# EAGLE design powermon (EAGLE 6.5.0)
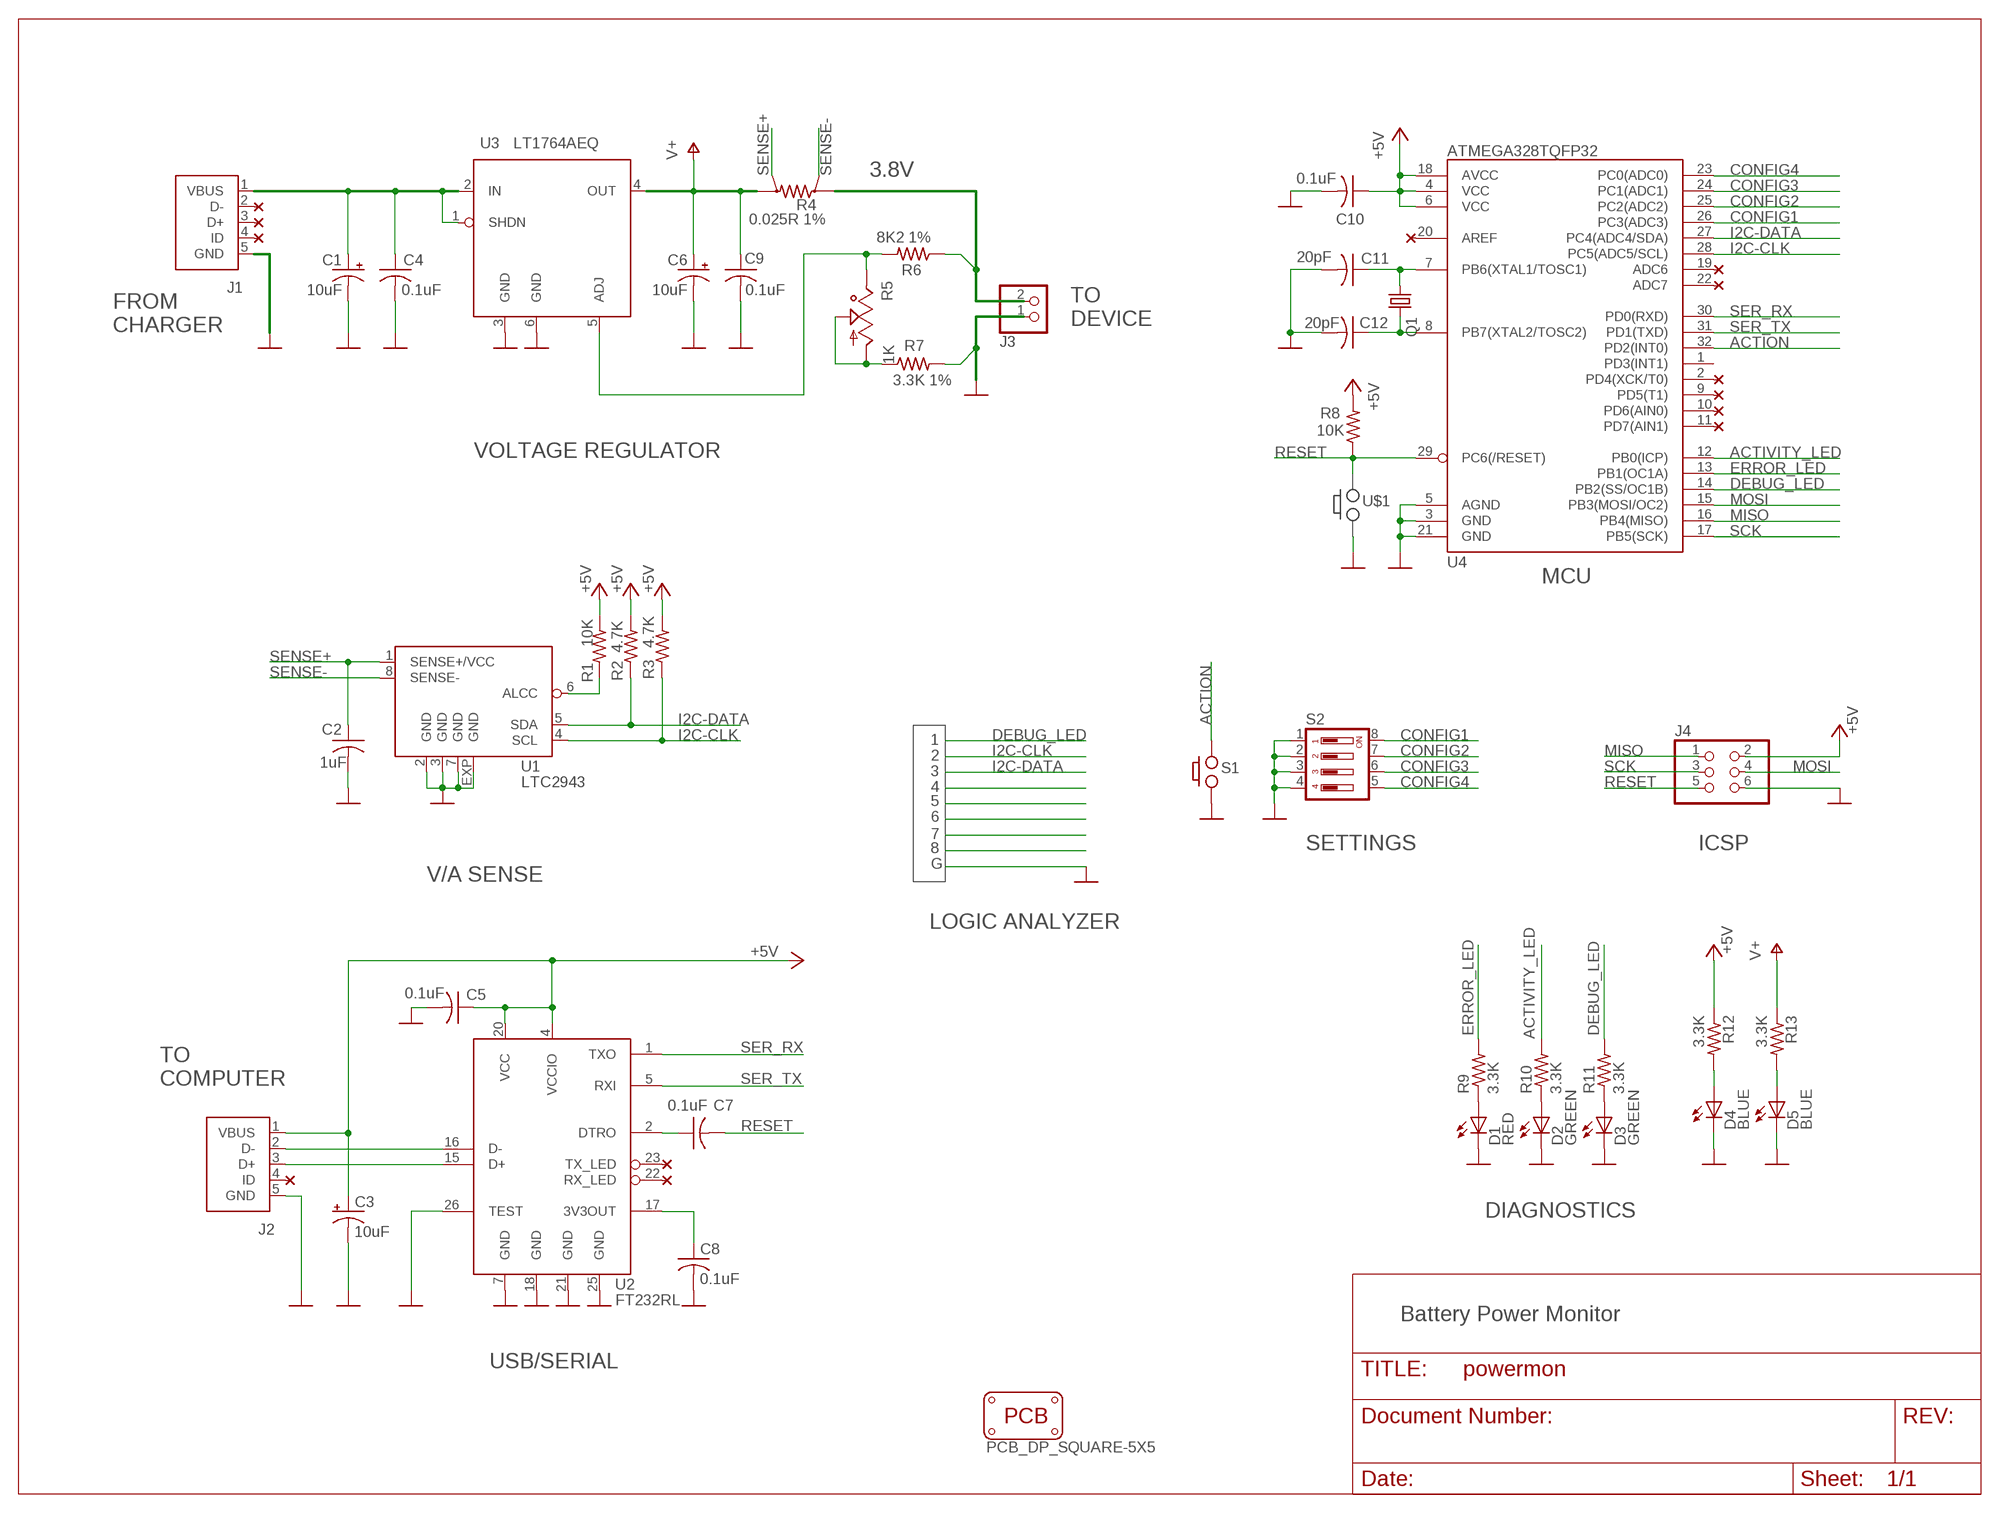
[diagram p0: schematic, sheet 1]

## Parts
C1  10uF  CPOL-USA/3216-18R  [A/3216-18R]
C2  1uF  C-USC0603  [C0603]
C3  10uF  CPOL-USA/3216-18R  [A/3216-18R]
C4  0.1uF  C-USC0603  [C0603]
C5  0.1uF  C-USC0603  [C0603]
C6  10uF  CPOL-USA/3216-18R  [A/3216-18R]
C7  0.1uF  C-USC0603  [C0603]
C8  0.1uF  C-USC0603  [C0603]
C9  0.1uF  C-USC0603  [C0603]
C10  0.1uF  C-USC0603  [C0603]
C11  20pF  C-USC0603  [C0603]
C12  20pF  C-USC0603  [C0603]
D1  RED  LED  [1206-LED]
D2  GREEN  LED  [1206-LED]
D3  GREEN  LED  [1206-LED]
D4  BLUE  LED  [1206-LED]
D5  BLUE  LED  [1206-LED]
J1  USB  [USB-MICRO-ZX62RD-AB-5P8]
J2  USB  [USB-MICRO-ZX62RD-AB-5P8]
J3  TERMINAL-2  [TERMINAL-2]
J4  PINHD-2X3  [2X03]
PCB1  PCB_DP_SQUARE-5X5  [DP5050_V1]
Q1  CRYSTALCTS406  [CRYSTAL-CTS406]
R1  10K  R-US_R0603  [R0603]
R2  4.7K  R-US_R0603  [R0603]
R3  4.7K  R-US_R0603  [R0603]
R4  0.025R 1%  SHUNT  [SHUNT]
R5  1K  TRIM_US-SM-42/43A  [TRIM-POT_SM-42/43A]
R6  8K2 1%  R-US_R0603  [R0603]
R7  3.3K 1%  R-US_R0603  [R0603]
R8  10K  R-US_R0603  [R0603]
R9  3.3K  R-US_R0603  [R0603]
R10  3.3K  R-US_R0603  [R0603]
R11  3.3K  R-US_R0603  [R0603]
R12  3.3K  R-US_R0603  [R0603]
R13  3.3K  R-US_R0603  [R0603]
S1  PUSH_BUTTONEVQPSL  [EVQPSL-PUSH-BUTTON]
S2  219-04  [CTS-219-04]
U1  LTC2943  [DFN8-3X3]
U2  FT232RL  [SSOP28DB]
U3  LT1764AEQ  LTE1764  [TO263-5]
U4  ATMEGA328TQFP32  [TQFP32-08]

## Nets
+5V: C3.+ C5.1 C10.1 J2.1(VBUS) J4.2 R1.2 R2.2 R3.2 R8.2 R12.1 U2.4(VCCIO) U2.20(VCC) U4.4(VCC) U4.6(VCC) U4.18(AVCC)
ACTION: S1.1 U4.32(PD2(INT0))
ACTIVITY_LED: R10.2 U4.12(PB0(ICP))
CONFIG1: S2.8 U4.26(PC3(ADC3))
CONFIG2: S2.7 U4.25(PC2(ADC2))
CONFIG3: S2.6 U4.24(PC1(ADC1))
CONFIG4: S2.5 U4.23(PC0(ADC0))
DEBUG_LED: R11.2 U4.14(PB2(SS/OC1B))
ERROR_LED: R9.2 U4.13(PB1(OC1A))
GND: C1.- C2.2 C3.- C4.2 C5.2 C6.- C8.2 C9.2 C10.2 C11.2 C12.2 D1.C D2.C D3.C D4.C D5.C J1.5(GND) J2.5(GND) J3.1 J4.6 R7.2 S1.2 S2.1 S2.2 S2.3 S2.4 U1.2(GND) U1.3(GND) U1.7(GND) U1.EXP(GND) U2.7(GND) U2.18(GND) U2.21(GND) U2.25(GND) U2.26(TEST) U3.3(GND) U3.6(GND) U4.3(GND) U4.5(AGND) U4.21(GND)
I2C-CLK: R3.1 U1.4(SCL) U4.28(PC5(ADC5/SCL))
I2C-DATA: R2.1 U1.5(SDA) U4.27(PC4(ADC4/SDA))
MISO: J4.1 U4.16(PB4(MISO))
MOSI: J4.4 U4.15(PB3(MOSI/OC2))
N$1: R1.1 U1.6(ALCC)
N$2: C11.1 Q1.1 U4.7(PB6(XTAL1/TOSC1))
N$3: D2.A R10.1
N$4: D1.A R9.1
N$7: C12.1 Q1.3 U4.8(PB7(XTAL2/TOSC2))
N$9: C1.+ C4.1 J1.1(VBUS) U3.1(SHDN) U3.2(IN)
N$10: J2.3(D+) U2.15(D+)
N$11: C7.1 U2.2(DTRO)
N$14: D5.A R13.2
N$15: J2.2(D-) U2.16(D-)
N$16: C8.1 U2.17(3V3OUT)
N$17: D4.A R12.2
N$18: R5.1 R5.2 R7.1
N$19: R5.3 R6.2 U3.5(ADJ)
N$20: D3.A R11.1
N$22: J3.2 R4.I1 R6.1
RESET: C7.2 J4.5 R8.1 U4.29(PC6(/RESET))
SCK: J4.3 U4.17(PB5(SCK))
SENSE+: C2.1 R4.V2 U1.1(SENSE+/VCC)
SENSE-: R4.V1 U1.8(SENSE-)
SER_RX: U2.1(TXO) U4.30(PD0(RXD))
SER_TX: U2.5(RXI) U4.31(PD1(TXD))
V+: C6.+ C9.1 R4.I2 R13.1 U3.4(OUT)
Unconnected: J1.2(D-) J1.3(D+) J1.4(ID) J2.4(ID) U2.22(RX_LED) U2.23(TX_LED) U4.1(PD3(INT1)) U4.2(PD4(XCK/T0)) U4.9(PD5(T1)) U4.10(PD6(AIN0)) U4.11(PD7(AIN1)) U4.19(ADC6) U4.20(AREF) U4.22(ADC7)

## Notes on the sheet
- 3.8V
- TO
  DEVICE
- FROM
  CHARGER
- VOLTAGE REGULATOR
- MCU
- 1
- 2
- 3
- 4
- 5
- 6
- 7
- 8 | SETTINGS | ICSP
- G
- V/A SENSE
- LOGIC ANALYZER
- TO
  COMPUTER
- DIAGNOSTICS
- Battery Power Monitor
- USB/SERIAL

## Library data of the parts
C1 C3 C6 = powermon:CPOL-US
C2 C4 C5 C7-C12 = powermon:C-US: CAPACITOR, American symbol
D1-D5 = powermon:LED
J1 J2 = powermon:USB
J3 = powermon:TERMINAL-2
J4 = powermon:PINHD-2X3
PCB1 = powermon:PCB_DP_SQUARE: Dangerous Prototypes Standard Square PCB sizes
Q1 = powermon:CRYSTAL: CRYSTAL; OC_FARNELL: unknown; OC_NEWARK: unknown
R1-R3 R6-R13 = powermon:R-US_: RESISTOR, American symbol
R4 = powermon:SHUNT: SMD SHUNT RESISTOR
R5 = powermon:TRIM_US-: POTENTIOMETER
S1 = powermon:PUSH_BUTTON: Panasonic EVQ-PSL02K, Digikey P12320CT-ND
S2 = powermon:219-04*: Surface Mount DIP Switch Series 219 SMT CTS Electronic Components Sourc: www.ctscorp.com; OC_FARNELL: unknown; OC_NEWARK: unknown
U1 = powermon:LTC2943
U2 = powermon:FT232RL
U3 = powermon:LTE1764
U4 = powermon:ATMEGA328

## Net classes
1 power: width 0.254 mm

## Board
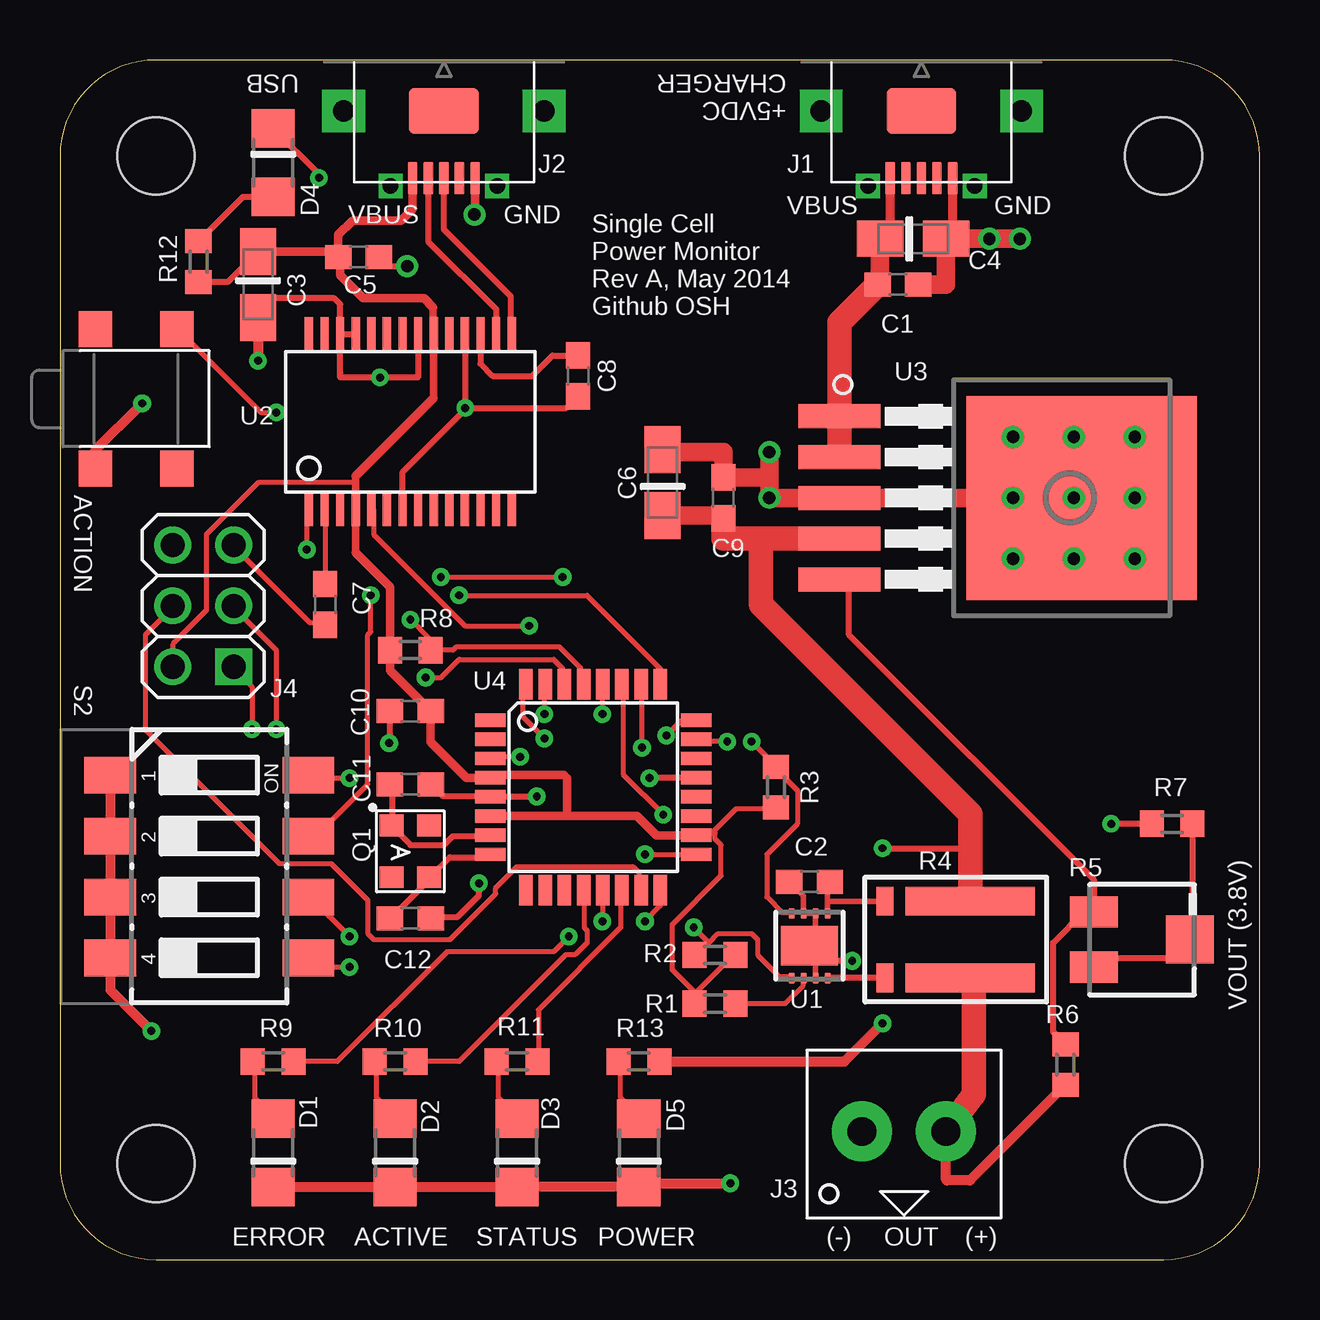
[diagram p1: board, top side]
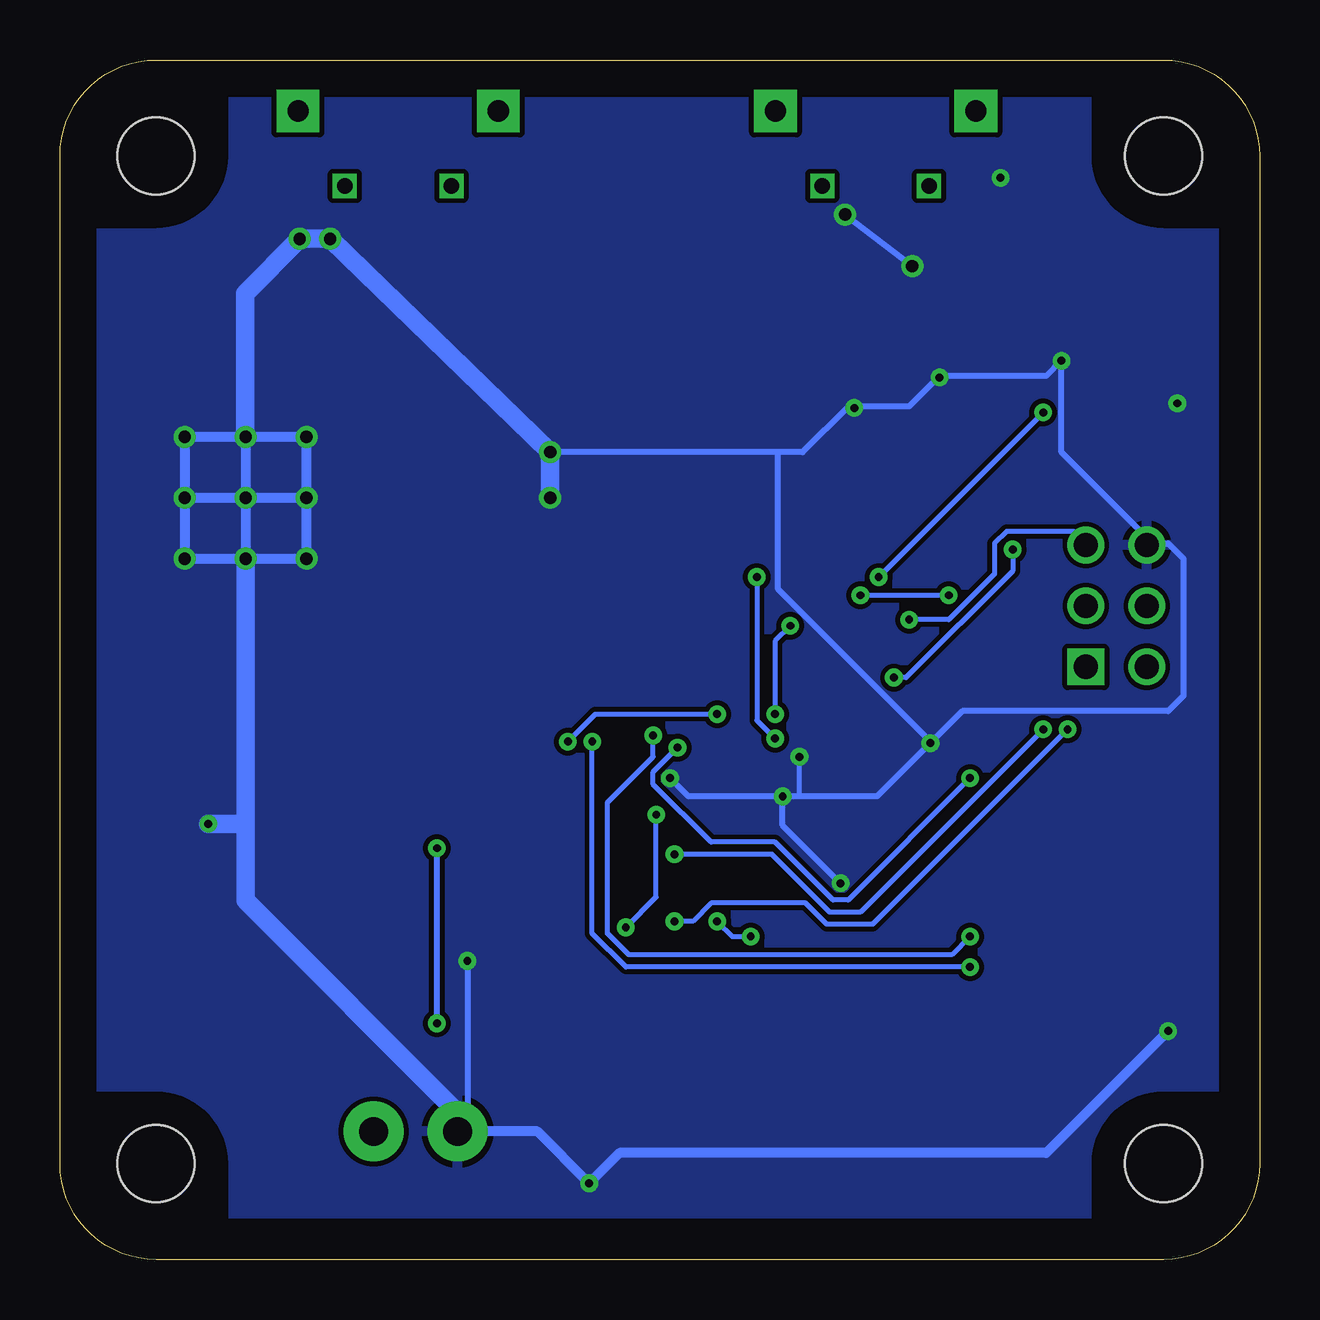
[diagram p2: board, bottom side, seen from below]

Size 50 x 50 mm. Coordinates in mm from the lower left corner, seen from the top.
Copper layers (1*16): Top 0.035mm / dielectric 1mm / bottom 0.035mm
Design rules "default *": minimum track width 8mil, minimum drill 13mil, track to track 8mil, track to pad 8mil, pad to pad 8mil, via to via 8mil, smd to smd 0mil, copper to edge 20mil, drill to drill 8mil, minimum pad ring 7mil, minimum via ring 8mil, stop-mask expansion 4mil, vias tented up to drill 20mil, thermal gap 10mil

### Footprints (pad centres in the part's own frame; a part is rotated, then mirrored left to right if it is on the bottom)
A/3216-18R = smd 1.95 x 1.5: + 1.375,0; - -1.375,0
C0603 = smd 1.1 x 1: 1 -0.85,0; 2 0.85,0
1206-LED = smd 1.6 x 1.803: A -1.422,0; C 1.422,0
USB-MICRO-ZX62RD-AB-5P8 = smd 0.4 x 1.35: 1 1.3,5.425; 2 0.65,5.425; 3 0,5.425; 4 -0.65,5.425; 5 -1.3,5.425 | drill 0.88 pad 1.778 square: A -4.175,2.625; D 4.175,2.625 | drill 0.65 pad 0.914 square: B -2.225,5.75; C 2.225,5.75 | smd 2.9 x 1.9: E 0,2.625
TERMINAL-2 = drill 1.2 pad 2.5: 1 -1.75,0; 2 1.75,0
2X03 = drill 1.016 square: 1 -2.54,-1.27 | drill 1.016: 2 -2.54,1.27; 3 0,-1.27; 4 0,1.27; 5 2.54,-1.27; 6 2.54,1.27
DP5050_V1 = hole 3.2: 4,4; 46,4; 46,46; 4,46
CRYSTAL-CTS406 = smd 0.9 x 1: 1 -1.075,-0.775; 2 1.075,-0.775; 3 1.075,0.775; 4 -1.075,0.775
R0603 = smd 1 x 1.1: 1 -0.85,0; 2 0.85,0
SHUNT = smd 1.2 x 5.4: I1 -1.6,2.7; I2 1.6,2.7 | smd 1.2 x 0.7: V1 -1.6,6.25; V2 1.6,6.25
TRIM-POT_SM-42/43A = smd 2 x 1.3: 1 2,1.15; 3 2,-1.15 | smd 2 x 2: 2 -2,0
EVQPSL-PUSH-BUTTON = smd 1.4 x 1.5: 1 -1.7,-2.9; 1A -1.7,2.9; 2 1.7,2.9; 2A 1.7,-2.9
CTS-219-04 = smd 1.524 x 2.159: 1 -3.81,-4.128; 2 -1.27,-4.128; 3 1.27,-4.128; 4 3.81,-4.128; 5 3.81,4.128; 6 1.27,4.128; 7 -1.27,4.128; 8 -3.81,4.128
DFN8-3X3 = smd 0.25 x 0.45: 1 -0.75,-1.35; 2 -0.25,-1.35; 3 0.25,-1.35; 4 0.75,-1.35; 5 0.75,1.35; 6 0.25,1.35; 7 -0.25,1.35; 8 -0.75,1.35 | smd 2.38 x 1.65: EXP 0,0
SSOP28DB = smd 0.348 x 1.397: 1 -4.225,-3.656; 2 -3.575,-3.656; 3 -2.925,-3.656; 4 -2.275,-3.656; 5 -1.625,-3.656; 6 -0.975,-3.656; 7 -0.325,-3.656; 8 0.325,-3.656; 9 0.975,-3.656; 10 1.625,-3.656; 11 2.275,-3.656; 12 2.925,-3.656; 13 3.575,-3.656; 14 4.225,-3.656; 15 4.225,3.656; 16 3.575,3.656; 17 2.925,3.656; 18 2.275,3.656; 19 1.625,3.656; 20 0.975,3.656; 21 0.325,3.656; 22 -0.325,3.656; 23 -0.975,3.656; 24 -1.625,3.656; 25 -2.275,3.656; 26 -2.925,3.656; 27 -3.575,3.656; 28 -4.225,3.656
TO263-5 = smd 1 x 3.4: 1 -3.4,-6.6; 2 -1.7,-6.6; 3 0,-6.6; 4 1.7,-6.6; 5 3.4,-6.6 | smd 8.5 x 9.6: 6 0,3.5
TQFP32-08 = smd 1.27 x 0.559: 1 -4.293,2.8; 2 -4.293,2; 3 -4.293,1.2; 4 -4.293,0.4; 5 -4.293,-0.4; 6 -4.293,-1.2; 7 -4.293,-2; 8 -4.293,-2.8; 17 4.293,-2.8; 18 4.293,-2; 19 4.293,-1.2; 20 4.293,-0.4; 21 4.293,0.4; 22 4.293,1.2; 23 4.293,2; 24 4.293,2.8 | smd 0.559 x 1.27: 9 -2.8,-4.293; 10 -2,-4.293; 11 -1.2,-4.293; 12 -0.4,-4.293; 13 0.4,-4.293; 14 1.2,-4.293; 15 2,-4.293; 16 2.8,-4.293; 25 2.8,4.293; 26 2,4.293; 27 1.2,4.293; 28 0.4,4.293; 29 -0.4,4.293; 30 -1.2,4.293; 31 -2,4.293; 32 -2.8,4.293

### Placement (x,y rotation side)
C1  35.56,42.55 180 top
C2  31.24,15.75 180 top
C3  8.26,40.64 90 top
C4  34.92,40.64 0 top
C5  12.45,41.78 0 top
C6  25.12,32.38 270 top
C7  11.05,27.3 270 top
C8  21.59,36.83 270 top
C9  27.66,31.75 90 top
C10  14.61,22.86 180 top
C11  14.61,19.81 0 top
C12  14.61,14.22 0 top
D1  8.89,4.45 270 top
D2  13.97,4.45 270 top
D3  19.05,4.45 270 top
D4  8.89,45.72 90 top
D5  24.13,4.45 270 top
J1  35.91,50.5 180 top
J2  16,50.5 180 top
J3  35.18,5.33 0 top
J4  5.97,27.24 90 top
PCB1  0,0 0 top
Q1  14.61,17.02 270 top
R1  27.3,10.67 180 top
R2  27.3,12.7 0 top
R3  29.84,19.68 270 top
R4  40.64,13.34 90 top
R5  45.09,13.34 180 top
R6  41.91,8.13 90 top
R7  46.35,18.16 180 top
R8  14.61,25.4 180 top
R9  8.89,8.26 0 top
R10  13.97,8.26 0 top
R11  19.05,8.26 0 top
R12  5.78,41.59 90 top
R13  24.13,8.26 180 top
S1  3.17,35.88 180 top
S2  6.22,16.38 270 top
U1  31.24,13.08 180 top
U2  14.61,34.92 0 top
U3  39.09,31.75 270 top
U4  22.23,19.68 0 top

### Tracks (layer width: path | path; a pad name or v marks a point on that pad's centre or on a via)
+5V
  Top 0.203: 27.24,17.84 27.18,17.78 26.67,17.78 U4.18 | 27.24,17.84 28.19,18.8 29.84,18.8 R3.2 | 26.54,11.05 26.54,11.18 28.07,12.7 R2.2 | 26.54,11.05 26.54,10.67 R1.2 26.54,11.05 | 26.54,11.05 25.53,12.06 25.53,13.97 27.56,16 27.56,17.27 27.3,17.53 27.3,17.78 27.24,17.84 | J4.2 4.7,25.65 6.1,27.05 6.1,30.23 8.26,32.38 12.33,32.38
  Top 0.254: 11.68,41.7 C5.1 11.36,42.02 | 15.56,38.6 U2.20 | 18.04,20.19 U4.4 17.91,20.07 | 21.02,20.19 21.14,20.07 | U2.4 12.32,31.26 | C3.+ 6.98,40.74 R12.1
  Top 0.305: U2.4 12.33,32.38 12.33,32.65 | 12.32,31.26 12.32,29.46 | 15.56,38.6 15.56,39.69 | U2.20 15.58,35.9
  Top 0.356: 11.68,41.7 11.68,41.02 12.64,40.07 15.18,40.07 15.56,39.69 | 12.33,32.65 15.58,35.9 | U4.6 21.14,18.48 | 21.14,18.48 24.06,18.48 24.86,17.68 U4.18 | 18.04,20.19 21.02,20.19 | 21.14,20.07 21.14,18.48 | 17.91,20.07 16.95,20.07 15.46,21.57 C10.1 13.76,24.56 R8.2 13.76,28.03 12.32,29.46 | J2.1 14.7,43.78 14.22,43.31 12.19,43.31 11.6,42.71 C5.1 | 11.36,42.02 C3.+
ACTION  (via drill 0.33)
  Top 0.203: v20.19,21.72 19.3,22.61 19.3,23.75 U4.32 | v15.88,28.45 v20.95,28.45 | v9.02,35.31 8.38,35.31 4.95,38.73 S1.1
  Top 0.254: 19.3,23.88 U4.32
  bottom 0.203: v20.19,21.72 20.95,22.48 v20.95,28.45 | v9.02,35.31 v15.88,28.45
ACTIVITY_LED
  Top 0.203: R10.2 16.64,8.26 21.08,12.7 21.46,12.7 21.97,13.21 21.97,13.72 21.84,13.84 21.84,15.37 U4.12
CONFIG1  (via drill 0.33)
  Top 0.203: v24.26,21.34 24.26,23.88 U4.26 | v12.06,20.07 10.54,20.07 10.41,20.19 S2.8
  bottom 0.203: v24.26,21.34 25.27,20.32 25.27,19.81 22.86,17.4 20.19,17.4 17.78,14.99 17.14,14.99 v12.06,20.07
CONFIG2  (via drill 0.33)
  Top 0.203: v16.64,27.69 21.97,27.69 25.02,24.64 25.02,24 U4.25 | v12.95,27.69 12.95,26.16 12.83,26.04 12.83,19.81 10.67,17.65 S2.7
  bottom 0.203: v12.95,27.69 v16.64,27.69
CONFIG3  (via drill 0.33)
  Top 0.203: v25.27,21.84 25.91,22.48 26.42,22.48 U4.24 | v12.06,13.46 10.41,15.11 S2.6
  bottom 0.203: v25.27,21.84 25.27,20.95 27.18,19.05 27.18,13.59 26.29,12.7 12.83,12.7 v12.06,13.46
CONFIG4  (via drill 0.33)
  Top 0.203: v27.81,21.59 26.54,21.59 U4.23 | v12.06,12.19 10.79,12.19 10.41,12.57 S2.5
  bottom 0.203: v27.81,21.59 27.81,13.59 26.42,12.19 v12.06,12.19
DEBUG_LED
  Top 0.203: R11.2 19.94,8.26 19.94,10.41 23.37,13.84 23.37,15.37 U4.14
ERROR_LED  (via drill 0.33)
  Top 0.203: R9.2 11.56,8.26 16.13,12.83 20.57,12.83 v21.21,13.46 | v22.61,14.1 22.61,15.24 U4.13
  Top 0.254: 22.48,15.24 22.61,15.37 U4.13
  bottom 0.203: v21.21,13.46 21.97,13.46 v22.61,14.1
GND  (via drill 0.33, 0.51)
  Top 0.203: v19.18,20.95 18.03,20.95 U4.3 | U3.6 v42.27,31.75
  Top 0.229: C2.2 30.99,15.15 U1.3 U1.2 31.49,13.33 U1.EXP | 31.5,11.81 31.5,12.83
  Top 0.254: U4.21 26.54,20.07 v24.57,20.07 | 16.89,38.61 U2.18 v16.89,35.5 | 25.63,33.66 C6.- | U2.26 11.68,38.61 11.68,39.81 11.43,40.07 8.45,40.07 8.38,40.01 8.26,40.13 C3.- | 12.32,38.61 U2.25 U2.26 | 31.5,12.45 31.5,12.83 U1.EXP | 31.5,11.81 U1.7 | 31.37,13.08 U1.EXP | v33.02,12.45 31.5,12.45 | 31.5,12.45 U1.EXP | v44.81,29.21 44.17,29.21 | v39.73,34.29 38.46,31.75 | 43.54,33.66 42.65,32.77 42.65,31.75 U3.6 | R7.2 v43.81,18.16 | C5.2 13.68,41.4 v14.48,41.4 | 17.3,43.59 v17.27,43.56 | U2.21 14.92,36.77 v13.34,36.77 11.68,36.77 11.68,36.96 U2.26 | U2.7 14.29,32.83 16.89,35.43 v16.89,35.5 | U4.5 17.93,19.3 | 17.93,19.3 15.96,19.3 C11.2 | 17.93,19.3 v19.88,19.3 | v13.72,21.53 13.76,21.57 C10.2 | C12.2 15.52,14.29 16.57,14.29 17.46,15.18 v17.46,15.68 | D4.C 10.79,45.24 v10.79,45.09 | v16.89,35.5 21.11,35.5 C8.2
  Top 0.356: J2.5 17.3,43.59
  Top 0.381: J1.5 37.2,42.55
  Top 0.406: 37.2,42.55 C1.- | D1.C D2.C D3.C D5.C 24.28,3.17 v27.94,3.17 | C3.- v8.26,37.47 | S2.1 S2.2 S2.3 S2.4 2.1,11.24 v3.81,9.53 | S1.2 1.48,33.73 v3.43,35.69
  Top 0.762: C4.2 36.94,40.64 C1.- v38.73,42.55 v40.01,42.55 | 38.46,31.75 U3.3 v29.57,31.75 v29.57,33.66 29.57,32.6 C9.2 27.66,33.66 25.63,33.66
  bottom 0.203: 19.18,19.3 v19.18,20.95
  bottom 0.254: v17.27,43.56 v14.48,41.4 | v19.88,19.3 23.81,19.3 v24.57,20.07 | v19.88,19.3 19.18,19.3 15.94,19.3 v13.72,21.53 12.38,22.86 3.81,22.86 3.17,23.5 3.17,29.21 3.81,29.84 4.45,29.84 8.26,33.66 v8.26,37.47 8.89,36.83 13.34,36.83 14.61,35.56 17.14,35.56 19.05,33.66 20.07,33.66 | v17.46,15.68 19.88,18.1 v19.88,19.3 | v33.02,12.45 33.02,6.12 J3.1 | 20.07,33.66 v29.57,33.66 | 13.72,21.59 20.07,27.94 20.07,33.66
  bottom 0.406: v42.27,34.29 v39.73,34.29 v39.73,31.75 | v42.27,34.29 42.29,34.29 v44.81,34.29 v44.81,31.75 | v44.81,31.75 v44.81,29.21 v42.27,29.21 | v42.27,29.21 v39.73,29.21 v39.73,31.75 | v39.73,31.75 v42.27,31.75 | v42.27,31.75 v44.81,31.75 | v42.27,34.29 v42.27,31.75 | v42.27,31.75 v42.27,29.21 | v3.81,9.53 8.89,4.45 26.67,4.45 v27.94,3.17 30.1,5.33 33.4,5.33
  bottom 0.762: v29.57,31.75 v29.57,33.66 v38.73,42.55 v40.01,42.55 42.29,40.26 42.29,34.29 | J3.1 33.43,6.12 42.27,14.96 42.27,17.42 | v43.81,18.16 42.29,18.16 42.27,17.42 | 42.27,17.42 v42.27,29.21
  pour bottom: 4.19,1.91 45.97,1.91 arc90 48.26,4.19 48.26,45.97 arc90 45.97,48.26 4.19,48.26 arc90 1.91,45.97 1.91,4.19 arc90
I2C-CLK  (via drill 0.33)
  Top 0.203: U1.4 30.48,14.48 30.1,14.48 29.46,15.11 29.46,16.89 30.73,18.16 30.73,19.56 29.84,20.45 R3.1 29.84,20.57 v28.83,21.59 | v22.61,22.73 22.61,23.75 U4.28
  Top 0.254: 22.61,23.88 U4.28
  bottom 0.203: v22.61,22.73 27.69,22.73 v28.83,21.59
I2C-DATA  (via drill 0.33)
  Top 0.203: 27.05,13.21 26.54,12.7 R2.1 | 27.05,13.21 27.43,13.59 28.83,13.59 29.08,13.34 29.08,12.7 29.97,11.81 30.48,11.81 U1.5 | v25.15,18.54 23.5,20.19 23.5,23.88 U4.27 | 27.05,13.21 v26.42,13.84
  bottom 0.203: v25.15,18.54 25.15,15.11 v26.42,13.84
MISO  (via drill 0.33)
  Top 0.203: v24.38,14.1 25.02,14.73 25.02,15.37 U4.16 | v8,22.1 8,23.88 7.24,24.64 J4.1
  bottom 0.203: v24.38,14.1 23.62,14.1 22.86,14.86 18.92,14.86 18.03,13.97 16.13,13.97 v8,22.1
MOSI
  Top 0.203: U4.15 24.13,15.49 24.13,16.13 23.88,16.38 19.05,16.38 18.16,15.49 18.16,15.24 16.26,13.34 13.08,13.34 12.83,13.59 12.83,14.99 11.3,16.51 9.14,16.51 3.56,22.1 3.56,26.04 4.7,27.18 J4.4
N$1
  Top 0.203: R1.1 30.23,10.67 30.99,11.43 30.99,11.68 U1.6
N$2
  Top 0.254: C11.1 13.84,19.68 13.84,18.16 Q1.1 13.84,18.03 14.61,17.27 16,17.27 16.38,17.65 17.91,17.65 U4.7
N$3
  Top 0.203: R10.1 13.21,8.26 13.21,6.73 13.97,5.97 D2.A
N$4
  Top 0.203: R9.1 8.13,8.26 8.13,6.73 8.89,5.97 D1.A
N$7
  Top 0.203: C12.1 13.84,14.22 14.22,14.61 14.19,14.64
  Top 0.254: U4.8 17.91,16.76 16.26,16.76 15.49,16 Q1.3 15.38,15.82 14.19,14.64 14.16,14.61
N$9
  Top 0.203: 34.6,43.18 34.54,43.05 34.29,42.8 C1.+
  Top 0.381: 34.6,43.18 J1.1
  Top 0.406: C4.1 34.19,40.64
  Top 0.762: 34.19,40.64 C1.+
  Top 1.016: U3.2 U3.1 32.49,39.06 C4.1
N$10
  Top 0.254: U2.15 18.8,38.62 18.8,40.13 16,42.93 J2.3
N$11
  Top 0.203: C7.1 11.05,31.24 U2.2
N$14
  Top 0.203: R13.2 23.37,8.26 23.37,6.73 24.13,5.97 D5.A
N$15
  Top 0.254: 18.16,38.6 U2.16 18.18,39.6 15.35,42.44 J2.2
N$16
  Top 0.254: U2.17 17.53,37.34 18.03,36.83 19.68,36.83 20.54,37.68 C8.1
N$17
  Top 0.254: R12.2 7.63,44.3 D4.A
N$18
  Top 0.254: R7.1 47.2,13.46 R5.2 47.09,12.92 46.74,12.57 43.47,12.57 R5.1
N$19
  Top 0.254: 34.01,28.57 33.79,28.35 33.02,28.35 | 33.02,28.35 U3.5 | 33.02,28.35 32.89,28.22 32.89,26.04 43.09,15.84 R5.3 42.68,14.48 41.4,13.21 41.4,9.49 R6.2
  Top 0.406: U3.5 32.74,28.35
N$20
  Top 0.203: R11.1 18.29,8.26 18.29,6.73 19.05,5.97 D3.A
N$22
  Top 0.406: R6.1 37.93,3.3 36.96,3.3 36.93,3.33 J3.2
  Top 0.762: 38.1,11.57 R4.I1
  Top 1.016: 38.1,11.57 38.1,6.89 J3.2
RESET  (via drill 0.33)
  Top 0.203: U4.29 21.72,24 21.72,24.64 20.83,25.53 16.51,25.53 16.38,25.4 R8.1 15.37,25.4 15.37,25.91 v14.61,26.67 | C7.2 11.05,26.54 10.41,26.54 7.24,29.72 J4.5
  bottom 0.203: v14.61,26.67 12.95,26.67 11.05,28.57 11.05,29.84 10.54,30.35 7.75,30.35 7.24,29.84 J4.5
SCK  (via drill 0.33)
  Top 0.203: v24.38,16.89 26.42,16.89 U4.17 | v9.02,22.1 9.02,25.4 7.24,27.18 J4.3
  bottom 0.203: v24.38,16.89 20.32,16.89 17.91,14.48 16.64,14.48 v9.02,22.1
SENSE+
  Top 0.229: U1.1 31.99,14.99 | 31.99,14.99 31.99,15.65 C2.1 | R4.V2 32.04,14.94 31.99,14.99
SENSE-
  Top 0.254: R4.V1 U1.8
SER_RX  (via drill 0.33)
  Top 0.203: v15.24,24.26 15.88,24.26 16.64,25.02 20.57,25.02 20.95,24.64 20.95,24.13 U4.30 | v10.29,29.59 10.29,31.24 U2.1
  Top 0.254: 20.95,24 U4.30 | 10.41,31.37 U2.1
  bottom 0.203: v15.24,24.26 14.73,24.26 10.29,28.7 v10.29,29.59
SER_TX  (via drill 0.33)
  Top 0.203: v20.19,22.73 20.19,23.88 U4.31 | v19.56,26.42 16.89,26.42 13.08,30.23 13.08,31.24 U2.5
  bottom 0.203: v20.19,22.73 20.19,25.78 v19.56,26.42
V+  (via drill 0.33)
  Top 0.254: v34.29,17.14 37.94,17.14
  Top 0.406: 27.55,31.01 C9.1 | R13.1 32.7,8.26 v34.29,9.84
  Top 0.762: 27.55,31.01 C6.+ | R4.I2 36.2,14.94
  Top 1.016: U3.4 29.21,30.05 | 29.21,30.05 27.66,30.05 C9.1 | R4.I2 37.94,17.14 37.94,18.57 29.21,27.3 29.21,30.05
  bottom 0.254: v34.29,9.84 v34.29,17.14

### Text on the board
tPlace: USB | +5VDC / CHARGER | VBUS | GND | VBUS | GND | Single Cell / Power Monitor / Rev A, May 2014 / Github OSH | ACTION | VOUT (3.8V) | ERROR | ACTIVE | STATUS | POWER | (-) | OUT | (+)